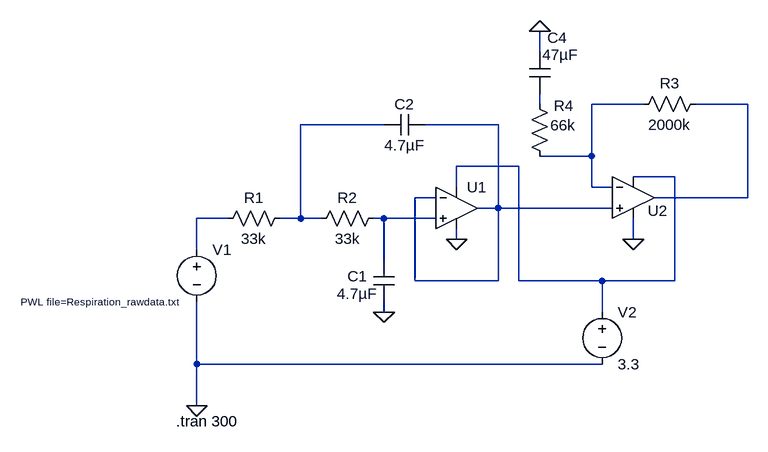
[diagram p0: schematic Respiration_Filter.asc]
Respiration_Filter.asc, the LTspice schematic file:
Version 4.1
SHEET 1 1452 680
WIRE 560 -160 560 -192
WIRE 560 -80 560 -96
WIRE 720 -80 640 -80
WIRE 880 -80 800 -80
WIRE 320 -48 192 -48
WIRE 496 -48 384 -48
WIRE 640 0 640 -80
WIRE 640 0 560 0
WIRE 528 16 432 16
WIRE 768 32 704 32
WIRE 432 48 432 16
WIRE 640 48 640 0
WIRE 672 48 640 48
WIRE 400 64 368 64
WIRE 880 64 880 -80
WIRE 880 64 736 64
WIRE 496 80 496 -48
WIRE 496 80 464 80
WIRE 672 80 496 80
WIRE 80 96 32 96
WIRE 192 96 192 -48
WIRE 192 96 160 96
WIRE 224 96 192 96
WIRE 320 96 304 96
WIRE 400 96 320 96
WIRE 432 128 432 112
WIRE 704 128 704 96
WIRE 32 144 32 96
WIRE 320 160 320 96
WIRE 368 192 368 64
WIRE 496 192 496 80
WIRE 496 192 368 192
WIRE 528 192 528 16
WIRE 656 192 528 192
WIRE 768 192 768 32
WIRE 768 192 656 192
WIRE 320 240 320 224
WIRE 656 240 656 192
WIRE 32 320 32 224
WIRE 656 320 32 320
WIRE 32 384 32 320
FLAG 320 240 0
FLAG 32 384 0
FLAG 560 -192 0
FLAG 704 128 0
FLAG 432 128 0
SYMBOL voltage 32 128 R0
WINDOW 123 0 0 Left 0
WINDOW 39 0 0 Left 0
WINDOW 3 -271 96 Left 1
SYMATTR InstName V1
SYMATTR Value PWL file=Respiration_rawdata.txt
SYMBOL res 176 80 R90
WINDOW 0 0 56 VBottom 2
WINDOW 3 32 56 VTop 2
SYMATTR InstName R1
SYMATTR Value 33k
SYMBOL res 320 80 R90
WINDOW 0 0 56 VBottom 2
WINDOW 3 32 56 VTop 2
SYMATTR InstName R2
SYMATTR Value 33k
SYMBOL OpAmps\\UniversalOpAmp2 432 80 R0
SYMATTR InstName U1
SYMBOL cap 304 160 R0
WINDOW 0 -40 25 Left 2
WINDOW 3 -56 52 Left 2
SYMATTR InstName C1
SYMATTR Value 4.7µF
SYMBOL cap 384 -64 R90
WINDOW 0 0 32 VBottom 2
WINDOW 3 32 32 VTop 2
SYMATTR InstName C2
SYMATTR Value 4.7µF
SYMBOL voltage 656 224 R0
WINDOW 123 0 0 Left 0
WINDOW 39 0 0 Left 0
SYMATTR InstName V2
SYMATTR Value 3.3
SYMBOL OpAmps\\UniversalOpAmp2 704 64 R0
WINDOW 0 22 20 Left 2
SYMATTR InstName U2
SYMBOL res 816 -96 R90
WINDOW 0 0 56 VBottom 2
WINDOW 3 32 56 VTop 2
SYMATTR InstName R3
SYMATTR Value 2000k
SYMBOL res 544 -96 R0
WINDOW 3 32 49 Left 2
WINDOW 0 38 19 Left 2
SYMATTR Value 66k
SYMATTR InstName R4
SYMBOL cap 544 -160 R0
WINDOW 0 28 -22 Left 2
WINDOW 3 20 4 Left 2
SYMATTR InstName C4
SYMATTR Value 47µF
TEXT 0 408 Left 2 !.tran 300

The netlist it stands for:
* Respiration_Filter.asc
V1 N007 0 PWL file=Respiration_rawdata.txt
R1 N004 N007 33k
R2 N008 N004 33k
X§U1 N008 N005 N006 0 N005 level2 Avol=1Meg GBW=10Meg Slew=10Meg Ilimit=25m Rail=0 Vos=0 En=0 Enk=0 In=0 Ink=0 Rin=500Meg  ; pins In+ In- V+ V- OUT
C1 N008 0 4.7µF
C2 N005 N004 4.7µF
V2 N006 0 3.3
X§U2 N005 N002 N006 0 N003 level2 Avol=1Meg GBW=10Meg Slew=10Meg Ilimit=25m Rail=0 Vos=0 En=0 Enk=0 In=0 Ink=0 Rin=500Meg  ; pins In+ In- V+ V- OUT
R3 N003 N002 2000k
R4 N001 N002 66k
C4 0 N001 47µF
.tran 300
.lib UniversalOpAmp2.lib
.backanno
.end